# EAGLE design sunbeamB (EAGLE 6.0)
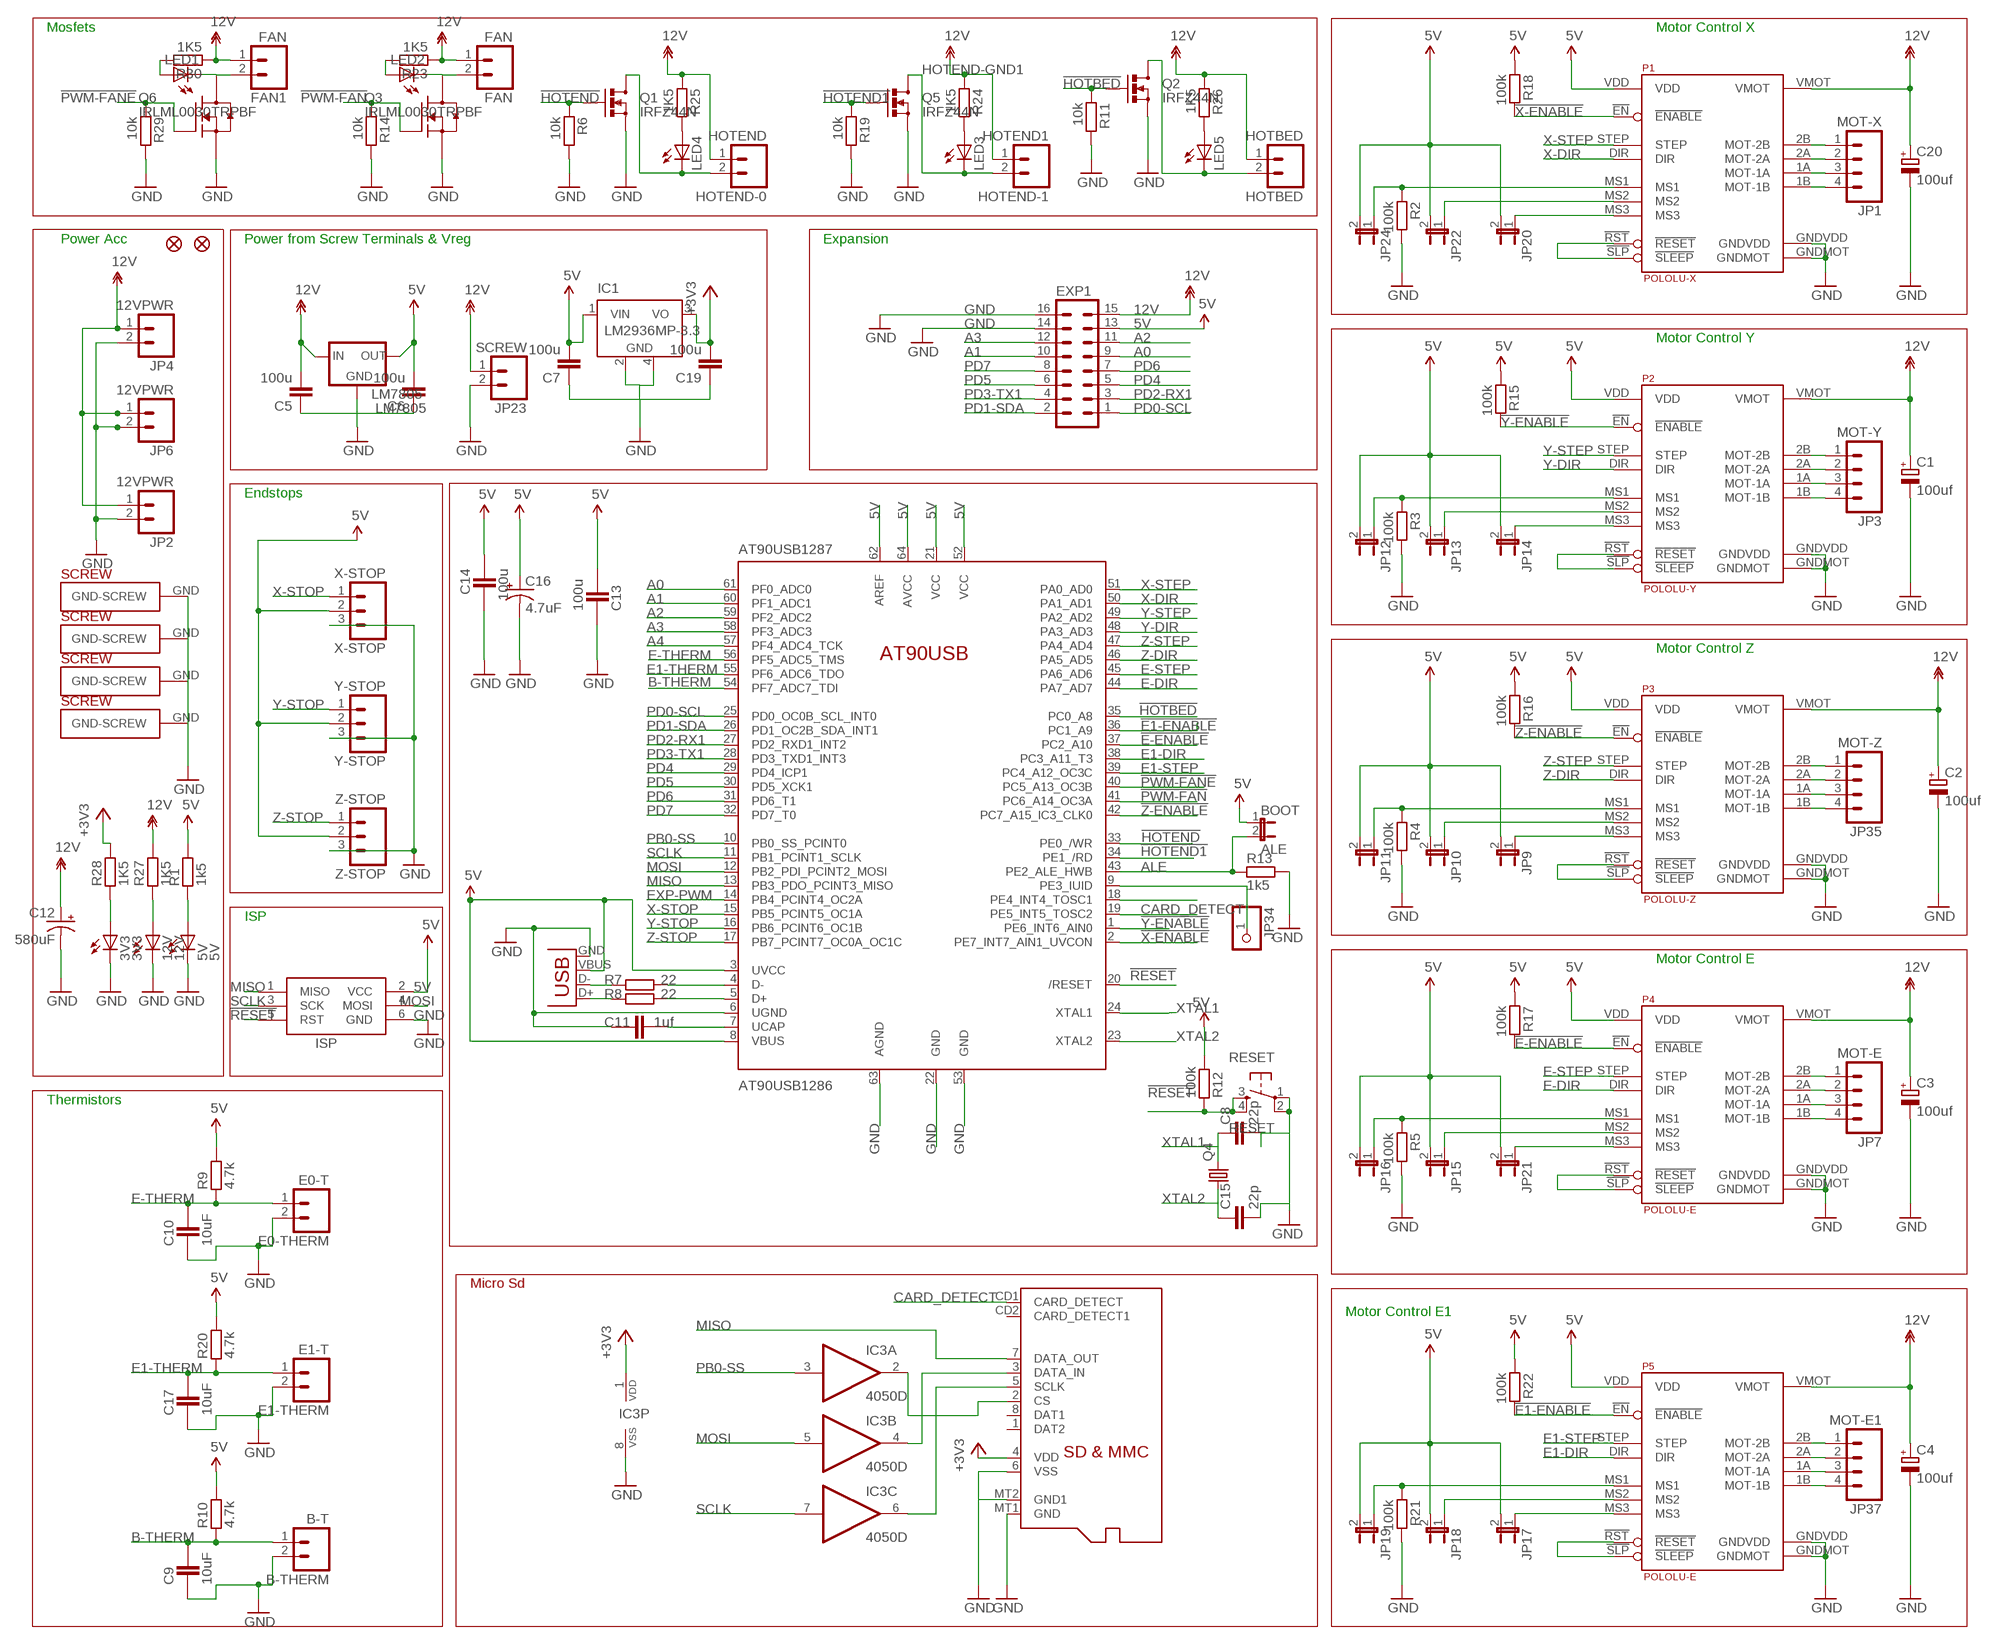
[diagram p0: schematic, sheet 1]

## Parts
3V3  3V3  LEDCHIPLED_0805  [CHIPLED_0805]
5V  5V  LEDCHIPLED_0805  [CHIPLED_0805]
12V  12V  LEDCHIPLED_0805  [CHIPLED_0805]
AT90USB1287  AT90USB1286  AT90USB  [TQFP64-2]
B-THERM  B-T  M02POLAR  [MOLEX-1X2]
BOOT  ALE  JUMPER-2PTH  [1X02]
C1  100uf  CPOL-EUUD-6,3X7,7  [UD-6,3X7,7_NICHICON]
C2  100uf  CPOL-EUUD-6,3X7,7  [UD-6,3X7,7_NICHICON]
C3  100uf  CPOL-EUUD-6,3X7,7  [UD-6,3X7,7_NICHICON]
C4  100uf  CPOL-EUUD-6,3X7,7  [UD-6,3X7,7_NICHICON]
C5  100u  C-EUC0805  [C0805]
C6  100u  C-EUC0805  [C0805]
C7  100u  C-EUC0805  [C0805]
C8  22p  C-EUC0805  [C0805]
C9  10uF  CAPACITOR_0805  [CAPC2012X145AN]
C10  10uF  CAPACITOR_0805  [CAPC2012X145AN]
C11  1uf  CAPACITOR_0805  [CAPC2012X145AN]
C12  580uF  CAP_POLPTH4  [CPOL-RADIAL-1000UF-25V]
C13  100u  CAPACITOR_0805  [CAPC2012X145AN]
C14  100u  CAPACITOR_0805  [CAPC2012X145AN]
C15  22p  C-EUC0805  [C0805]
C16  4.7uF  CAP_POLPTH2  [CPOL-RADIAL-10UF-25V]
C17  10uF  CAPACITOR_0805  [CAPC2012X145AN]
C19  100u  C-EUC0805  [C0805]
C20  100uf  CPOL-EUUD-6,3X7,7  [UD-6,3X7,7_NICHICON]
E0-THERM  E0-T  M02POLAR  [MOLEX-1X2]
E1-THERM  E1-T  M02POLAR  [MOLEX-1X2]
EXP1  MA08-2  [MA08-2]
FAN  FAN  M02POLAR  [MOLEX-1X2]
FAN1  FAN  M02POLAR  [MOLEX-1X2]
HOTBED  HOTBED  M025MM  [SCREWTERMINAL-5MM-2]
HOTEND-0  HOTEND  M025MM  [SCREWTERMINAL-5MM-2]
HOTEND-1  HOTEND1  M025MM  [SCREWTERMINAL-5MM-2]
IC1  LM2936MP-3.3  [SOT223]
IC3  4050D  [SO16]
ISP  ISP  AVRISP-6  [AVRISP]
J1  USB  USBPTH  [USB-B-PTH]
JP1  MOT-X  M04POLAR  [MOLEX-1X4]
JP2  12VPWR  M02POLAR  [MOLEX-1X2]
JP3  MOT-Y  M04POLAR  [MOLEX-1X4]
JP4  12VPWR  M02POLAR  [MOLEX-1X2]
JP5  FIDUCIAL1X2.5  [FIDUCIAL-1X2.5]
JP6  12VPWR  M02POLAR  [MOLEX-1X2]
JP7  MOT-E  M04POLAR  [MOLEX-1X4]
JP8  FIDUCIAL1X2.5  [FIDUCIAL-1X2.5]
JP9  JUMPER-2-OLDSMD-NO  [SJ_2S-NO]
JP10  JUMPER-2-OLDSMD-NO  [SJ_2S-NO]
JP11  JUMPER-2-OLDSMD-NO  [SJ_2S-NO]
JP12  JUMPER-2-OLDSMD-NO  [SJ_2S-NO]
JP13  JUMPER-2-OLDSMD-NO  [SJ_2S-NO]
JP14  JUMPER-2-OLDSMD-NO  [SJ_2S-NO]
JP15  JUMPER-2-OLDSMD-NO  [SJ_2S-NO]
JP16  JUMPER-2-OLDSMD-NO  [SJ_2S-NO]
JP17  JUMPER-2-OLDSMD-NO  [SJ_2S-NO]
JP18  JUMPER-2-OLDSMD-NO  [SJ_2S-NO]
JP19  JUMPER-2-OLDSMD-NO  [SJ_2S-NO]
JP20  JUMPER-2-OLDSMD-NO  [SJ_2S-NO]
JP21  JUMPER-2-OLDSMD-NO  [SJ_2S-NO]
JP22  JUMPER-2-OLDSMD-NO  [SJ_2S-NO]
JP23  SCREW  M025MM  [SCREWTERMINAL-5MM-2]
JP24  JUMPER-2-OLDSMD-NO  [SJ_2S-NO]
JP34  PINHD-1X1  [1X01]
JP35  MOT-Z  M04POLAR  [MOLEX-1X4]
JP37  MOT-E1  M04POLAR  [MOLEX-1X4]
LED1  LEDCHIPLED_0805  [CHIPLED_0805]
LED2  LEDCHIPLED_0805  [CHIPLED_0805]
LED3  LEDCHIPLED_0805  [CHIPLED_0805]
LED4  LEDCHIPLED_0805  [CHIPLED_0805]
LED5  LEDCHIPLED_0805  [CHIPLED_0805]
LM7805  LM7805  V_REG_78XX  [78XXL-CUSTOM]
MICRO-SD  MICROSD  [MICROSD]
P1  POLOLU-X  POLOLU-ALLEGRO  [POLOLU-ALLEGRO-PTH]
P2  POLOLU-Y  POLOLU-ALLEGRO  [POLOLU-ALLEGRO-PTH]
P3  POLOLU-Z  POLOLU-ALLEGRO  [POLOLU-ALLEGRO-PTH]
P4  POLOLU-E  POLOLU-ALLEGRO  [POLOLU-ALLEGRO-PTH]
P5  POLOLU-E  POLOLU-ALLEGRO  [POLOLU-ALLEGRO-PTH]
Q1  IRFZ44N  MOSFET-NCHANNELPTH2  [TO220V]
Q2  IRFZ44N  MOSFET-NCHANNELPTH2  [TO220V]
Q3  IRLML0030TRPBF  MOSFET-NCH_SOT-23  [SOT95P280X135-3N]
Q4  CRYSTALHC49UP  [HC49UP]
Q5  IRFZ44N  MOSFET-NCHANNELPTH2  [TO220V]
Q6  IRLML0030TRPBF  MOSFET-NCH_SOT-23  [SOT95P280X135-3N]
R1  1k5  RESISTOR_0805  [RESC2012X70N]
R2  100k  RESISTOR_0805  [RESC2012X70N]
R3  100k  RESISTOR_0805  [RESC2012X70N]
R4  100k  RESISTOR_0805  [RESC2012X70N]
R5  100k  RESISTOR_0805  [RESC2012X70N]
R6  10k  RESISTOR_0805  [RESC2012X70N]
R7  22  RESISTOR_0805  [RESC2012X70N]
R8  22  RESISTOR_0805  [RESC2012X70N]
R9  4.7k  RESISTOR_0805  [RESC2012X70N]
R10  4.7k  RESISTOR_0805  [RESC2012X70N]
R11  10k  RESISTOR_0805  [RESC2012X70N]
R12  100k  RESISTOR_0805  [RESC2012X70N]
R13  1k5  RESISTOR_0805  [RESC2012X70N]
R14  10k  RESISTOR_0805  [RESC2012X70N]
R15  100k  RESISTOR_0805  [RESC2012X70N]
R16  100k  RESISTOR_0805  [RESC2012X70N]
R17  100k  RESISTOR_0805  [RESC2012X70N]
R18  100k  RESISTOR_0805  [RESC2012X70N]
R19  10k  RESISTOR_0805  [RESC2012X70N]
R20  4.7k  RESISTOR_0805  [RESC2012X70N]
R21  100k  RESISTOR_0805  [RESC2012X70N]
R22  100k  RESISTOR_0805  [RESC2012X70N]
R23  1K5  RESISTOR_0805  [RESC2012X70N]
R24  1K5  RESISTOR_0805  [RESC2012X70N]
R25  1K5  RESISTOR_0805  [RESC2012X70N]
R26  1K5  RESISTOR_0805  [RESC2012X70N]
R27  1K5  RESISTOR_0805  [RESC2012X70N]
R28  1K5  RESISTOR_0805  [RESC2012X70N]
R29  10k  RESISTOR_0805  [RESC2012X70N]
R30  1K5  RESISTOR_0805  [RESC2012X70N]
RESET  RESET  TAC_SWITCHPTH  [TACTILE-PTH]
U$47  PLATED-SCREW  [PLATEDSCREW]
U$48  PLATED-SCREW  [PLATEDSCREW]
U$49  PLATED-SCREW  [PLATEDSCREW]
U$50  PLATED-SCREW  [PLATEDSCREW]
X-STOP  X-STOP  M03POLAR  [MOLEX-1X3]
Y-STOP  Y-STOP  M03POLAR  [MOLEX-1X3]
Z-STOP  Z-STOP  M03POLAR  [MOLEX-1X3]

## Nets
5V: AT90USB1287.3(UVCC) AT90USB1287.8(VBUS) AT90USB1287.21(VCC) AT90USB1287.52(VCC) AT90USB1287.62(AREF) AT90USB1287.64(AVCC) BOOT.1 C6.2 C7.2 C13.2 C14.1 C16.1(+) EXP1.13 IC1.1(VIN) ISP.2(VCC) J1.VBUS JP9.2 JP10.2 JP11.2 JP12.2 JP13.2 JP14.2 JP15.2 JP16.2 JP17.2 JP18.2 JP19.2 JP20.2 JP21.2 JP22.2 JP24.2 LM7805.OUT P1.VDD P2.VDD P3.VDD P4.VDD P5.VDD R1.2 R9.2 R10.2 R12.2 R15.1 R16.1 R17.1 R18.1 R20.2 R22.1 X-STOP.2 Y-STOP.2 Z-STOP.2
12V: C1.+ C2.+ C3.+ C4.+ C5.2 C12.1(+) C20.+ EXP1.15 FAN1.1 FAN.1 HOTBED.1 HOTEND-0.1 HOTEND-1.1 JP2.1 JP4.1 JP6.1 JP23.1 LM7805.IN P1.VMOT P2.VMOT P3.VMOT P4.VMOT P5.VMOT R23.1 R24.1 R25.1 R26.1 R27.2 R30.1
!E1-ENABLE: AT90USB1287.36(PC1_A9) P5.!EN(!ENABLE) R22.2
!E-ENABLE: AT90USB1287.37(PC2_A10) P4.!EN(!ENABLE) R17.2
!HOTBED: AT90USB1287.35(PC0_A8) Q2.1(G) R11.1
!HOTEND: AT90USB1287.33(PE0_/WR) Q1.1(G) R6.1
!HOTEND1: AT90USB1287.34(PE1_/RD) Q5.1(G) R19.1
!PWM-FAN: AT90USB1287.41(PC6_A14_OC3A) Q3.1(G) R14.1
!PWM-FANE: AT90USB1287.40(PC5_A13_OC3B) Q6.1(G) R29.1
!RESET: AT90USB1287.20(/RESET) ISP.5(RST) R12.1 RESET.3 RESET.4
!X-ENABLE: AT90USB1287.2(PE7_INT7_AIN1_UVCON) P1.!EN(!ENABLE) R18.2
!Y-ENABLE: AT90USB1287.1(PE6_INT6_AIN0) P2.!EN(!ENABLE) R15.2
!Z-ENABLE: AT90USB1287.42(PC7_A15_IC3_CLK0) P3.!EN(!ENABLE) R16.2
+3V3: C19.2 IC1.3(VO) IC3.1(P:VDD) MICRO-SD.4(VDD) R28.2
A0: AT90USB1287.61(PF0_ADC0) EXP1.9
A1: AT90USB1287.60(PF1_ADC1) EXP1.10
A2: AT90USB1287.59(PF2_ADC2) EXP1.11
A3: AT90USB1287.58(PF3_ADC3) EXP1.12
A4: AT90USB1287.57(PF4_ADC4_TCK)
ALE: AT90USB1287.43(PE2_ALE_HWB) BOOT.2 R13.1
B-THERM: AT90USB1287.54(PF7_ADC7_TDI) B-THERM.1 C9.2 R10.1
CARD_DETECT: AT90USB1287.19(PE5_INT5_TOSC2) MICRO-SD.CD1(CARD_DETECT)
E1-DIR: AT90USB1287.38(PC3_A11_T3) P5.DIR
E1-STEP: AT90USB1287.39(PC4_A12_OC3C) P5.STEP
E1-THERM: AT90USB1287.55(PF6_ADC6_TDO) C17.2 E1-THERM.1 R20.1
E-DIR: AT90USB1287.44(PA7_AD7) P4.DIR
E-MOT-1A [power]: JP7.3 P4.1A(MOT-1A)
E-MOT-1A1 [power]: JP37.3 P5.1A(MOT-1A)
E-MOT-1B [power]: JP7.4 P4.1B(MOT-1B)
E-MOT-1B1 [power]: JP37.4 P5.1B(MOT-1B)
E-MOT-2A [power]: JP7.2 P4.2A(MOT-2A)
E-MOT-2A1 [power]: JP37.2 P5.2A(MOT-2A)
E-MOT-2B [power]: JP7.1 P4.2B(MOT-2B)
E-MOT-2B1 [power]: JP37.1 P5.2B(MOT-2B)
E-MS1: JP16.1 P4.MS1 R5.1
E-MS2: JP15.1 P4.MS2
E-MS3: JP21.1 P4.MS3
E-MS4: JP19.1 P5.MS1 R21.1
E-MS5: JP18.1 P5.MS2
E-MS6: JP17.1 P5.MS3
E-RESETSLEEP: P4.!RST(!RESET) P4.!SLP(!SLEEP)
E-RESETSLEEP1: P5.!RST(!RESET) P5.!SLP(!SLEEP)
E-STEP: AT90USB1287.45(PA6_AD6) P4.STEP
E-THERM: AT90USB1287.56(PF5_ADC5_TMS) C10.2 E0-THERM.1 R9.1
EXP-PWM: AT90USB1287.14(PB4_PCINT4_OC2A)
GND [power]: 3V3.C 5V.C 12V.C AT90USB1287.6(UGND) AT90USB1287.22(GND) AT90USB1287.53(GND) AT90USB1287.63(AGND) B-THERM.2 C1.- C2.- C3.- C4.- C5.1 C6.1 C7.1 C8.2 C9.1 C10.1 C11.1 C12.2(-) C13.1 C14.2 C15.2 C16.2(-) C17.1 C19.1 C20.- E0-THERM.2 E1-THERM.2 EXP1.14 EXP1.16 IC1.2(GND) IC1.4(GND) IC3.8(P:VSS) ISP.6(GND) J1.GND JP2.2 JP4.2 JP6.2 JP23.2 LM7805.GND MICRO-SD.6(VSS) MICRO-SD.MT1(GND) MICRO-SD.MT2(GND1) P1.GNDMOT P1.GNDVDD P2.GNDMOT P2.GNDVDD P3.GNDMOT P3.GNDVDD P4.GNDMOT P4.GNDVDD P5.GNDMOT P5.GNDVDD Q1.3(S) Q2.3(S) Q3.2(S) Q5.3(S) Q6.2(S) R2.2 R3.2 R4.2 R5.2 R6.2 R11.2 R13.2 R14.2 R19.2 R21.2 R29.2 RESET.1 RESET.2 U$47.GND(GND-SCREW) U$48.GND(GND-SCREW) U$49.GND(GND-SCREW) U$50.GND(GND-SCREW) X-STOP.3 Y-STOP.3 Z-STOP.3
HOTBED-GND [power]: HOTBED.2 LED5.C Q2.2(D)
HOTEND-GND: HOTEND-0.2 LED4.C Q1.2(D)
HOTEND-GND1 [power]: HOTEND-1.2 LED3.C Q5.2(D)
MISO: AT90USB1287.13(PB3_PDO_PCINT3_MISO) ISP.1(MISO) MICRO-SD.7(DATA_OUT)
MOSI: AT90USB1287.12(PB2_PDI_PCINT2_MOSI) IC3.5(B:I) ISP.4(MOSI)
N$1: 5V.A R1.1
N$2: J1.D- R7.1
N$3: AT90USB1287.4(D-) R7.2
N$4: AT90USB1287.5(D+) R8.2
N$5: J1.D+ R8.1
N$6: FAN.2 LED2.C Q3.3(D)
N$7: AT90USB1287.9(PE3_IUID) JP34.1
N$8: LED2.A R23.2
N$9: AT90USB1287.7(UCAP) C11.2
N$10: 3V3.A R28.1
N$11: LED4.A R25.2
N$12: LED3.A R24.2
N$13: LED5.A R26.2
N$14: 12V.A R27.1
N$15: AT90USB1287.18(PE4_INT4_TOSC1)
N$16: IC3.6(C:O) MICRO-SD.5(SCLK)
N$17: IC3.4(B:O) MICRO-SD.3(DATA_IN)
N$18: IC3.2(A:O) MICRO-SD.2(CS)
N$20: FAN1.2 LED1.C Q6.3(D)
N$21: LED1.A R30.2
PB0-SS: AT90USB1287.10(PB0_SS_PCINT0) IC3.3(A:I)
PD0-SCL: AT90USB1287.25(PD0_OC0B_SCL_INT0) EXP1.1
PD1-SDA: AT90USB1287.26(PD1_OC2B_SDA_INT1) EXP1.2
PD2-RX1: AT90USB1287.27(PD2_RXD1_INT2) EXP1.3
PD3-TX1: AT90USB1287.28(PD3_TXD1_INT3) EXP1.4
PD4: AT90USB1287.29(PD4_ICP1) EXP1.5
PD5: AT90USB1287.30(PD5_XCK1) EXP1.6
PD6: AT90USB1287.31(PD6_T1) EXP1.7
PD7: AT90USB1287.32(PD7_T0) EXP1.8
SCLK: AT90USB1287.11(PB1_PCINT1_SCLK) IC3.7(C:I) ISP.3(SCK)
X-DIR: AT90USB1287.50(PA1_AD1) P1.DIR
X-MOT-1A [power]: JP1.3 P1.1A(MOT-1A)
X-MOT-1B [power]: JP1.4 P1.1B(MOT-1B)
X-MOT-2A [power]: JP1.2 P1.2A(MOT-2A)
X-MOT-2B [power]: JP1.1 P1.2B(MOT-2B)
X-MS1: JP24.1 P1.MS1 R2.1
X-MS2: JP22.1 P1.MS2
X-MS3: JP20.1 P1.MS3
X-RESETSLEEP: P1.!RST(!RESET) P1.!SLP(!SLEEP)
X-STEP: AT90USB1287.51(PA0_AD0) P1.STEP
X-STOP: AT90USB1287.15(PB5_PCINT5_OC1A) X-STOP.1
XTAL1: AT90USB1287.24(XTAL1) C8.1 Q4.2
XTAL2: AT90USB1287.23(XTAL2) C15.1 Q4.1
Y-DIR: AT90USB1287.48(PA3_AD3) P2.DIR
Y-MOT-1A [power]: JP3.3 P2.1A(MOT-1A)
Y-MOT-1B [power]: JP3.4 P2.1B(MOT-1B)
Y-MOT-2A [power]: JP3.2 P2.2A(MOT-2A)
Y-MOT-2B [power]: JP3.1 P2.2B(MOT-2B)
Y-MS1: JP12.1 P2.MS1 R3.1
Y-MS2: JP13.1 P2.MS2
Y-MS3: JP14.1 P2.MS3
Y-RESETSLEEP: P2.!RST(!RESET) P2.!SLP(!SLEEP)
Y-STEP: AT90USB1287.49(PA2_AD2) P2.STEP
Y-STOP: AT90USB1287.16(PB6_PCINT6_OC1B) Y-STOP.1
Z-DIR: AT90USB1287.46(PA5_AD5) P3.DIR
Z-MOT-1A [power]: JP35.3 P3.1A(MOT-1A)
Z-MOT-1B [power]: JP35.4 P3.1B(MOT-1B)
Z-MOT-2A [power]: JP35.2 P3.2A(MOT-2A)
Z-MOT-2B [power]: JP35.1 P3.2B(MOT-2B)
Z-MS1: JP11.1 P3.MS1 R4.1
Z-MS2: JP10.1 P3.MS2
Z-MS3: JP9.1 P3.MS3
Z-RESETSLEEP: P3.!RST(!RESET) P3.!SLP(!SLEEP)
Z-STEP: AT90USB1287.47(PA4_AD4) P3.STEP
Z-STOP: AT90USB1287.17(PB7_PCINT7_OC0A_OC1C) Z-STOP.1
Unconnected: IC3.9(D:I) IC3.10(D:O) IC3.11(E:I) IC3.12(E:O) IC3.14(F:I) IC3.15(F:O) MICRO-SD.1(DAT2) MICRO-SD.8(DAT1) MICRO-SD.CD2(CARD_DETECT1)

## Notes on the sheet
- Mosfets | Motor Control X
- Power Acc | Power from Screw Terminals & Vreg | Expansion
- Motor Control Y
- Endstops
- Motor Control Z
- ISP
- Motor Control E
- Thermistors
- Micro Sd
- Motor Control E1

## Library data of the parts
3V3 5V 12V LED1-LED5 = led:LED: LED OSRAM: - CHIPLED LG R971, LG N971, LY N971, LG Q971, LY Q971, LO R971, LY R971 LH N974, LH R974 LS Q976, LO Q976, LY Q976 LO Q996 - Hyper CHIPLED LW Q18S LB Q993, LB Q99A, LB R99A - SideLED LS A670, LO A670, LY A670, LG A670, LP A670 LB A673, LV A673, LT A673, LW A673 LH A674 LY A675 LS A676, LA A676, LO A676, LY A676, LW A676 LS A679, LY A679, LG A679 - Hyper Micro SIDELED® LS Y876, LA Y876, LO Y876, LY Y876 LT Y87S - SmartLED LW L88C, LW L88S LB L89C, LB L89S, LG L890 LS L89K, LO L89K, LY L89K LS L896, LA L896, LO L896, LY L896 - TOPLED LS T670, LO T670, LY T670, LG T670, LP T670 LSG T670, LSP T670, LSY T670, LOP T670, LYG T670 LG T671, LOG T671, LSG T671 LB T673, LV T673, LT T673, LW T673 LH T674 LS T676, LA T676, LO T676, LY T676, LB T676, LH T676, LSB T676, LW T676 LB T67C, LV T67C, LT T67C, LS T67K, LO T67K, LY T67K, LW E67C LS E67B, LA E67B, LO E67B, LY E67B, LB E67C, LV E67C, LT E67C LW T67C LS T679, LY T679, LG T679 LS T770, LO T770, LY T770, LG T770, LP T770 LB T773, LV T773, LT T773, LW T773 LH T774 LS E675, LA E675, LY E675, LS T675 LS T776, LA T776, LO T776, LY T776, LB T776 LHGB T686 LT T68C, LB T68C - Hyper Mini TOPLED® LB M676 - Mini TOPLED Santana® LG M470 LS M47K, LO M47K, LY M47K Source: http://www.osram.convergy.de LUXEON: - LUMILED® LXK2-PW12-R00, LXK2-PW12-S00, LXK2-PW14-U00, LXK2-PW14-V00 LXK2-PM12-R00, LXK2-PM12-S00, LXK2-PM14-U00 LXK2-PE12-Q00, LXK2-PE12-R00, LXK2-PE12-S00, LXK2-PE14-T00, LXK2-PE14-U00 LXK2-PB12-K00, LXK2-PB12-L00, LXK2-PB12-M00, LXK2-PB14-N00, LXK2-PB14-P00, LXK2-PB14-Q00 LXK2-PR12-L00, LXK2-PR12-M00, LXK2-PR14-Q00, LXK2-PR14-R00 LXK2-PD12-Q00, LXK2-PD12-R00, LXK2-PD12-S00 LXK2-PH12-R00, LXK2-PH12-S00 LXK2-PL12-P00, LXK2-PL12-Q00, LXK2-PL12-R00 Source: www.luxeon.com KINGBRIGHT: KA-3528ASYC Source: www.kingbright.com
AT90USB1287 = Atmel-at90usb-teensy:AT90USB
B-THERM E0-THERM E1-THERM FAN FAN1 HOTBED HOTEND-0 HOTEND-1 JP2 JP4 JP6 JP23 = SparkFun:M02: Header 2 Standard 2-pin 0.1" header. Use with straight break away headers (SKU : PRT-00116), right angle break away headers (PRT-00553), swiss pins (PRT-00743), machine pins (PRT-00117), and female headers (PRT-00115). Molex polarized connector foot print use with SKU : PRT-08233 with associated crimp pins and housings.
BOOT = SparkFun:JUMPER-2: Jumper Basic 0.1" spaced jumper. Use with breakaway headers.
C1-C4 C20 = rcl:CPOL-EU: POLARIZED CAPACITOR, European symbol
C5-C8 C15 C19 = rcl:C-EU: CAPACITOR, European symbol
C9-C11 C13 C14 C17 = ipc-7351-capacitor:CAPACITOR_
C12 C16 = SparkFun:CAP_POL: Capacitor Polarized These are standard SMD and PTH capacitors. Normally 10uF, 47uF, and 100uF in electrolytic and tantalum varieties. Always verify the external diameter of the through hole cap, it varies with capacity, voltage, and manufacturer. The EIA devices should be standard.
EXP1 = con-lstb:MA08-2: PIN HEADER; OC_FARNELL: unknown; OC_NEWARK: unknown
IC1 = national-semiconductor:LM2936MP?*: Ultra-Low Quiescent Current LDO Voltage Regulator Source: Data sheet <http://www.national.com/ds/LM/LM2936.pdf>; MF: NATIONAL SEMICONDUCTOR; MPN: LM2936MP-3.3/NOPB; OC_FARNELL: 1469062; OC_NEWARK: 41K4523
IC3 = 40xx:4050: Hex non-inverting BUFFER
ISP = adafruit:AVRISP: AVR ISP HEADER Standard 6 pin header for AVR programming
J1 = SparkFun:USB: USB Connectors USB-B-PTH is fully proven SKU : PRT-00139 USB-miniB is fully proven SKU : PRT-00587 USB-A-PCB is untested. USB-A-H is throughly reviewed, but untested. Spark Fun Electronics SKU : PRT-00437 USB-B-SMT is throughly reviewed, but untested. Needs silkscreen touching up. USB-A-S has not been used/tested USB-MB-H has not been used/tested
JP1 JP3 JP7 JP35 JP37 = SparkFun:M04: Header 4 Standard 4-pin 0.1" header. Use with straight break away headers (SKU : PRT-00116), right angle break away headers (PRT-00553), swiss pins (PRT-00743), machine pins (PRT-00117), and female headers (PRT-00115). Molex polarized connector foot print use with SKU : PRT-08231 with associated crimp pins and housings.
JP5 JP8 = SparkFun:FIDUCIAL: Fiducial Alignment Points Various fiducial points for machine vision alignment.
JP9-JP22 JP24 = SparkFun:JUMPER-2-OLD: Jumper Basic 0.1" spaced jumper. Use with breakaway headers.
JP34 = pinhead:PINHD-1X1: PIN HEADER
LM7805 = SparkFun:V_REG_78XX: Voltage Regulator Standard 7805 5V regulator. IGO (Input Ground Output). Spark Fun Electronics SKU : COM-00107
MICRO-SD = adafruit:MICROSD: Micro-SD / Transflash card holder with SPI pinout For the 3M # 2908-05WB-MG and/or 4UCON #19656 push-push type
P1-P5 = pololu-allegro:POLOLU-ALLEGRO
Q1 Q2 Q5 = SparkFun:MOSFET-NCHANNEL
Q3 Q6 = ipc-7351-transistor:MOSFET-NCH_
Q4 = crystal:CRYSTAL: CRYSTAL; OC_FARNELL: unknown; OC_NEWARK: unknown
R1-R30 = ipc-7351-resistor:RESISTOR_
RESET = SparkFun:TAC_SWITCH: Momentary Switch Button commonly used for reset or general input. Spark Fun Electronics SKU : COM-00097
U$47-U$50 = Sanguinololu:PLATED-SCREW
X-STOP Y-STOP Z-STOP = SparkFun:M03: Header 3 Standard 3-pin 0.1" header. Use with straight break away headers (SKU : PRT-00116), right angle break away headers (PRT-00553), swiss pins (PRT-00743), machine pins (PRT-00117), and female headers (PRT-00115). Molex polarized connector foot print use with SKU : PRT-08232 with associated crimp pins and housings.

## Board
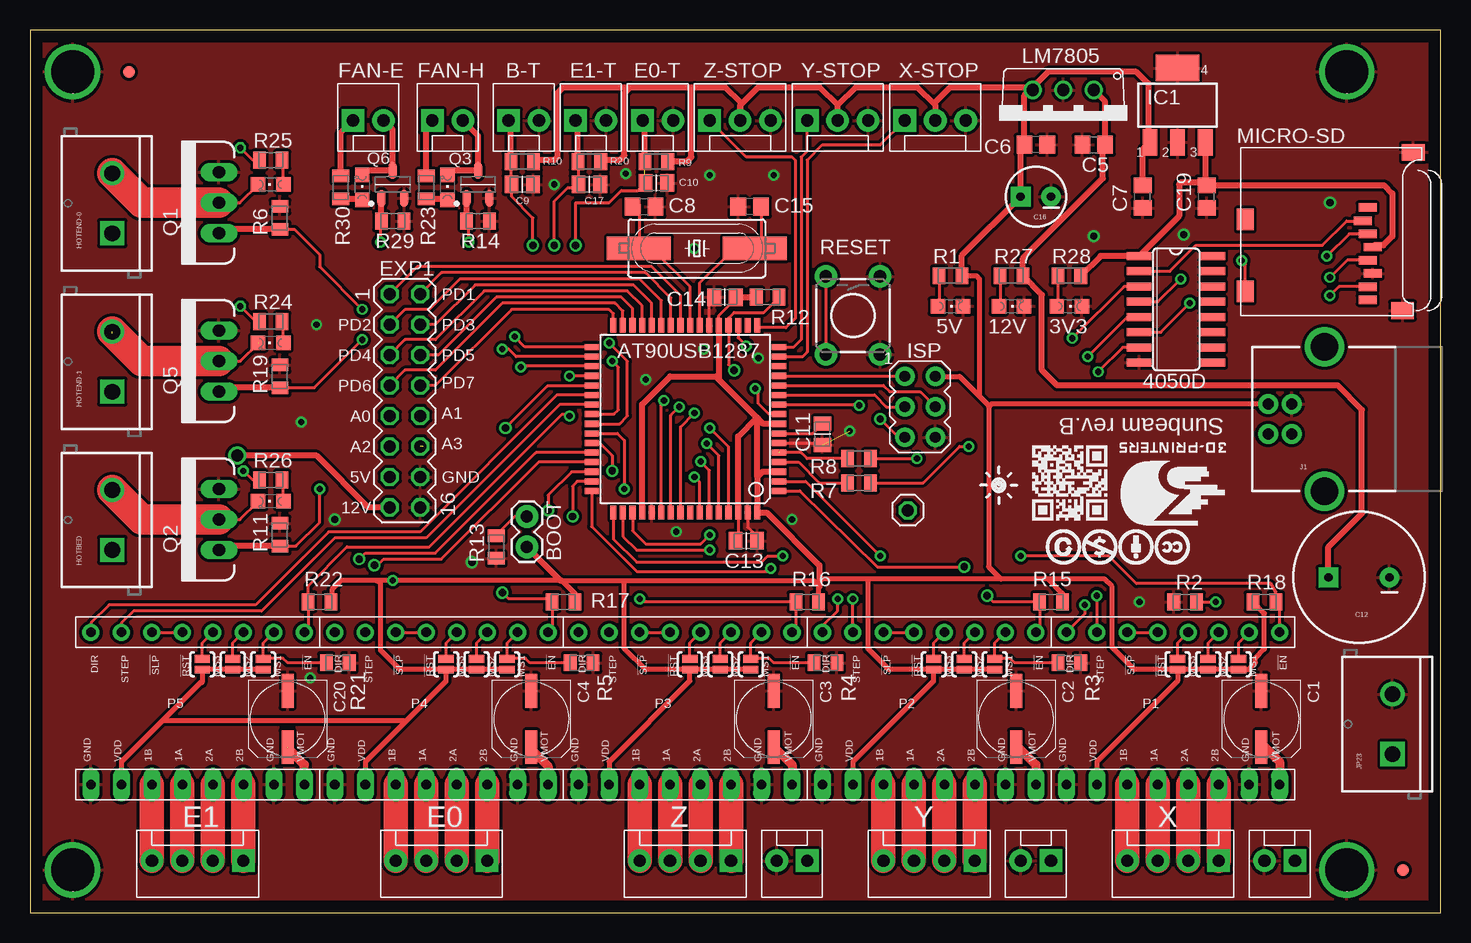
[diagram p1: board, top side]
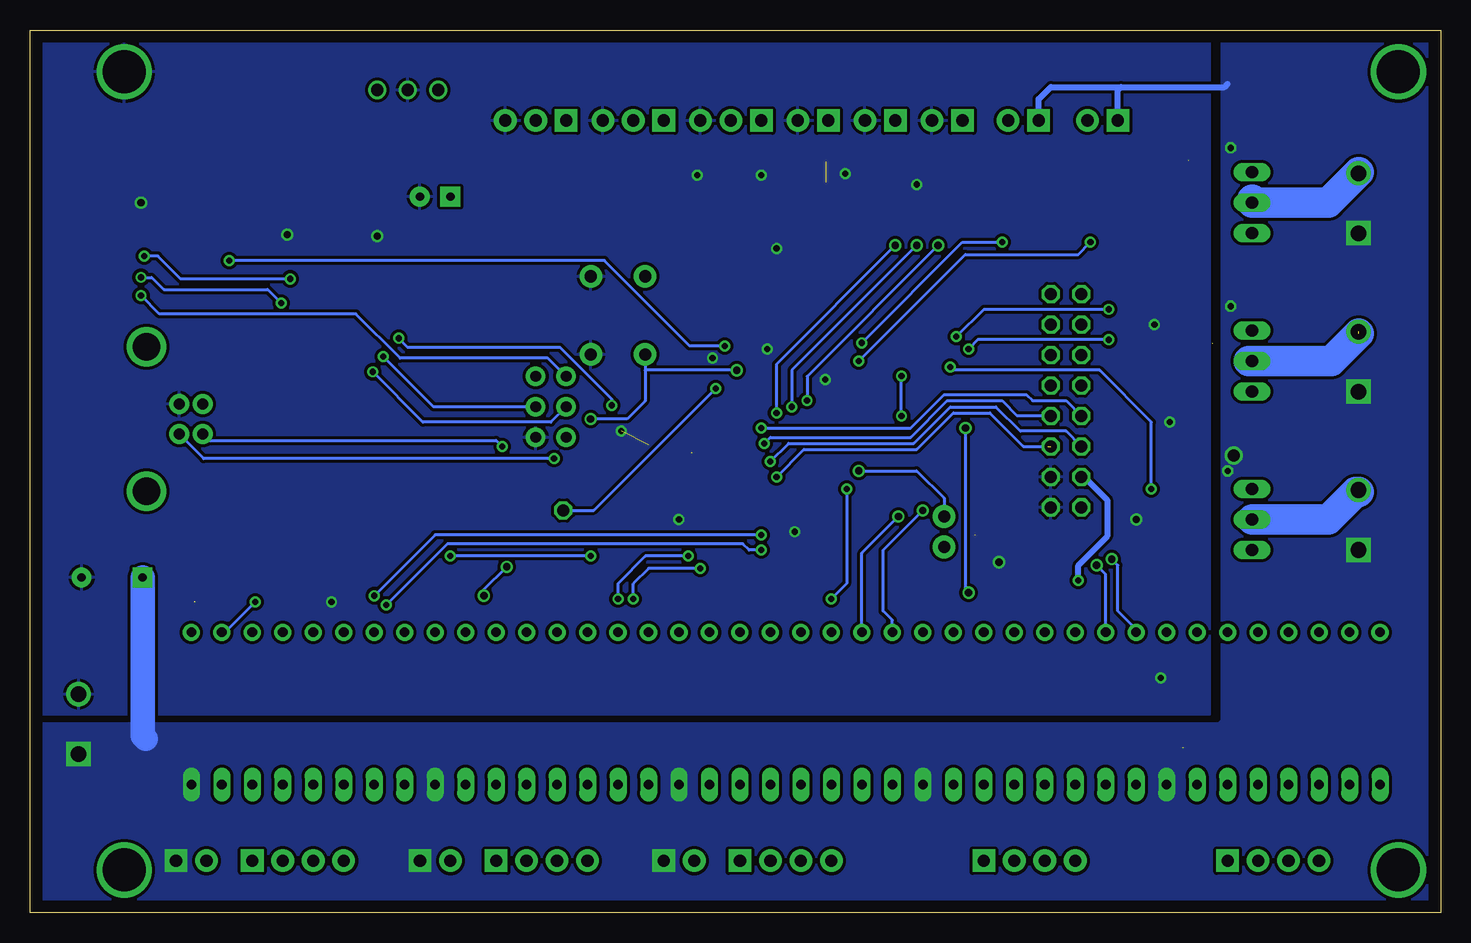
[diagram p2: board, bottom side, seen from below]

Size 117.58 x 73.58 mm. Coordinates in mm from the lower left corner, seen from the top.
Outline: 0,0 117.58,0 117.58,73.58 0,73.58 0,0
Copper layers (1*16): Top 0.035mm / dielectric 1.5mm / Bottom 0.035mm
Design rules: minimum track width 10mil, minimum drill 8mil, track to track 10mil, track to pad 10mil, pad to pad 10mil, via to via 10mil, smd to smd 10mil, copper to edge 40mil, drill to drill 8mil, minimum pad ring 10mil, minimum via ring 8mil, stop-mask expansion 4mil, vias tented up to drill 0mil, thermal gap 10mil

### Footprints (pad centres in the part's own frame; a part is rotated, then mirrored left to right if it is on the bottom)
CHIPLED_0805 = smd 1.2 x 1.2: A 0,-1.05; C 0,1.05
TQFP64-2 = smd 1.194 x 0.508: 1 -7.8,6; 2 -7.8,5.2; 3 -7.8,4.4; 4 -7.8,3.6; 5 -7.8,2.8; 6 -7.8,2; 7 -7.8,1.2; 8 -7.8,0.4; 9 -7.8,-0.4; 10 -7.8,-1.2; 11 -7.8,-2; 12 -7.8,-2.8; 13 -7.8,-3.6; 14 -7.8,-4.4; 15 -7.8,-5.2; 16 -7.8,-6; 33 7.8,-6; 34 7.8,-5.2; 35 7.8,-4.4; 36 7.8,-3.6; 37 7.8,-2.8; 38 7.8,-2; 39 7.8,-1.2; 40 7.8,-0.4; 41 7.8,0.4; 42 7.8,1.2; 43 7.8,2; 44 7.8,2.8; 45 7.8,3.6; 46 7.8,4.4; 47 7.8,5.2; 48 7.8,6 | smd 0.508 x 1.194: 17 -6,-7.8; 18 -5.2,-7.8; 19 -4.4,-7.8; 20 -3.6,-7.8; 21 -2.8,-7.8; 22 -2,-7.8; 23 -1.2,-7.8; 24 -0.4,-7.8; 25 0.4,-7.8; 26 1.2,-7.8; 27 2,-7.8; 28 2.8,-7.8; 29 3.6,-7.8; 30 4.4,-7.8; 31 5.2,-7.8; 32 6,-7.8; 49 6,7.8; 50 5.2,7.8; 51 4.4,7.8; 52 3.6,7.8; 53 2.8,7.8; 54 2,7.8; 55 1.2,7.8; 56 0.4,7.8; 57 -0.4,7.8; 58 -1.2,7.8; 59 -2,7.8; 60 -2.8,7.8; 61 -3.6,7.8; 62 -4.4,7.8; 63 -5.2,7.8; 64 -6,7.8
MOLEX-1X2 = drill 1.016 pad 1.88 square: 1 0,0 | drill 1.016 pad 1.88: 2 2.54,0
1X02 = drill 1.016 pad 1.88: 1 0,0; 2 2.54,0
UD-6,3X7,7_NICHICON = smd 2.8 x 1: + 2.35,0; - -2.35,0
C0805 = smd 1.3 x 1.5: 1 -0.95,0; 2 0.95,0
CAPC2012X145AN = smd 1.15 x 1.45: 1 -0.9,0; 2 0.9,0
CPOL-RADIAL-1000UF-25V = drill 0.7 pad 1.651 square: 1 2.54,0 | drill 0.7 pad 1.651: 2 -2.54,0
CPOL-RADIAL-10UF-25V = drill 0.7 pad 1.651 square: 1 1.27,0 | drill 0.7 pad 1.651: 2 -1.27,0
MA08-2 = drill 1.016 octagon: 1 -8.89,-1.27; 2 -8.89,1.27; 3 -6.35,-1.27; 4 -6.35,1.27; 5 -3.81,-1.27; 6 -3.81,1.27; 7 -1.27,-1.27; 8 -1.27,1.27; 9 1.27,-1.27; 10 1.27,1.27; 11 3.81,-1.27; 12 3.81,1.27; 13 6.35,-1.27; 14 6.35,1.27; 15 8.89,-1.27; 16 8.89,1.27
SCREWTERMINAL-5MM-2 = drill 1.3 pad 2.032 square: 1 0,0 | drill 1.3 pad 2.032: 2 5,0
SOT223 = smd 1.219 x 2.235: 1 -2.311,-3.099; 2 0,-3.099; 3 2.311,-3.099 | smd 3.6 x 2.2: 4 0,3.099
SO16 = smd 0.66 x 2.032: 1 -4.445,-3.073; 2 -3.175,-3.073; 3 -1.905,-3.073; 4 -0.635,-3.073; 5 0.635,-3.073; 6 1.905,-3.073; 7 3.175,-3.073; 8 4.445,-3.073; 9 4.445,3.073; 10 3.175,3.073; 11 1.905,3.073; 12 0.635,3.073; 13 -0.635,3.073; 14 -1.905,3.073; 15 -3.175,3.073; 16 -4.445,3.073
AVRISP = drill 0.9 pad 1.626: 1 -1.27,2.54; 2 1.27,2.54; 3 -1.27,0; 4 1.27,0; 5 -1.27,-2.54; 6 1.27,-2.54
USB-B-PTH = drill 0.914 pad 1.676: D+ 0,1.25; D- 1.981,1.25; GND 0,-1.25; VBUS 1.981,-1.25 | drill 2.286: P$1 -2.718,-6.02; P$2 -2.718,6.02
MOLEX-1X4 = drill 1.016 pad 1.88 square: 1 0,0 | drill 1.016 pad 1.88: 2 2.54,0; 3 5.08,0; 4 7.62,0
FIDUCIAL-1X2.5 = smd 1 x 1: 1 0,0
SJ_2S-NO = smd 0.635 x 1.27: 1 -0.45,0; 2 0.45,0
1X01 = drill 1.016 octagon: 1 0,0
78XXL-CUSTOM = drill 1.016: GND 0,0; IN -2.54,0; OUT 2.54,0
MICROSD = smd 0.7 x 1.5: 1 9,-10.64; 2 7.9,-10.24; 3 6.8,-10.64; 4 5.7,-11.04; 5 4.6,-10.64; 6 3.5,-11.04; 7 2.4,-10.64; 8 1.3,-10.64 | smd 1.8 x 1.4: CD1 2,-0.44; CD2 8,-0.44 | smd 1.4 x 1.9: MT1 0.4,-13.54; MT2 13.6,-14.44
POLOLU-ALLEGRO-PTH = drill 0.8 pad 1.422 long: 1A 6.35,-1.27; 1B 6.35,-3.81; 2A 6.35,1.27; 2B 6.35,3.81; GNDMOT 6.35,6.35; GNDVDD 6.35,-8.89; VDD 6.35,-6.35; VMOT 6.35,8.89 | drill 0.8 pad 1.422: !EN -6.35,8.89; !RST -6.35,-1.27; !SLP -6.35,-3.81; DIR -6.35,-8.89; MS1 -6.35,6.35; MS2 -6.35,3.81; MS3 -6.35,1.27; STEP -6.35,-6.35
TO220V = drill 1.016 long: 1 -2.54,0; 2 0,0; 3 2.54,0
SOT95P280X135-3N = smd 1.4 x 0.65: 1 -1.15,0.95; 2 -1.15,-0.95; 3 1.15,0
HC49UP = smd 5.334 x 1.93: 1 -4.826,0; 2 4.826,0
RESC2012X70N = smd 1.05 x 1.4: 1 -0.95,0; 2 0.95,0
TACTILE-PTH = drill 1.016 pad 1.88: 1 -3.251,2.261; 2 3.251,2.261; 3 -3.251,-2.261; 4 3.251,-2.261
PLATEDSCREW = drill 3.6: GND 0,0
MOLEX-1X3 = drill 1.016 pad 1.88 square: 1 0,0 | drill 1.016 pad 1.88: 2 2.54,0; 3 5.08,0

### Placement (x,y rotation side)
3V3  86.61,50.55 270 top
5V  76.71,50.55 270 top
12V  81.79,50.55 270 top
AT90USB1287  54.61,41.15 180 top
B-THERM  39.88,66.04 0 top
BOOT  41.4,30.48 90 top
C1  102.62,16.13 270 top
C2  82.17,16.13 270 top
C3  61.98,16.13 270 top
C4  41.78,16.13 270 top
C5  88.65,64.01 0 top
C6  83.82,64.01 180 top
C7  92.71,59.69 90 top
C8  51.17,58.85 0 top
C9  41.02,60.71 180 top
C10  52.2,60.83 180 top
C11  66.04,39.88 90 top
C12  110.74,27.94 180 top
C13  59.69,30.99 180 top
C14  57.91,51.31 180 top
C15  59.97,58.85 180 top
C16  83.82,59.69 180 top
C17  46.61,60.71 180 top
C19  98.04,59.69 90 top
C20  21.46,16.13 270 top
E0-THERM  51.05,66.04 0 top
E1-THERM  45.47,66.04 0 top
EXP1  31.24,42.67 270 top
FAN  33.53,66.04 0 top
FAN1  26.92,66.04 0 top
HOTBED  6.86,30.23 90 top
HOTEND-0  6.86,56.64 90 top
HOTEND-1  6.86,43.43 90 top
IC1  95.63,67.31 0 top
IC3  95.5,50.29 270 top
ISP  74.17,42.16 0 top
J1  105.16,41.15 180 top
JP1  99.06,4.32 180 top
JP2  105.41,4.32 180 top
JP3  78.74,4.32 180 top
JP4  85.09,4.32 180 top
JP5  114.43,3.56 0 top
JP6  64.77,4.32 180 top
JP7  38.1,4.32 180 top
JP8  8.25,70.1 0 top
JP9  54.99,20.7 270 top
JP10  57.53,20.7 270 top
JP11  60.07,20.7 270 top
JP12  80.39,20.7 270 top
JP13  77.85,20.7 270 top
JP14  75.31,20.7 270 top
JP15  37.21,20.7 270 top
JP16  39.75,20.7 270 top
JP17  14.35,20.7 270 top
JP18  16.89,20.7 270 top
JP19  19.43,20.7 270 top
JP20  95.63,20.7 270 top
JP21  34.67,20.7 270 top
JP22  98.17,20.7 270 top
JP23  113.54,13.21 90 top
JP24  100.71,20.7 270 top
JP34  73.15,33.53 270 top
JP35  58.42,4.32 180 top
JP37  17.78,4.32 180 top
LED1  27.69,60.45 0 top
LED2  34.8,60.45 0 top
LED3  20.07,47.5 90 top
LED4  20.07,60.71 90 top
LED5  20.07,34.29 90 top
LM7805  86.11,68.58 180 top
MICRO-SD  100.84,49.78 90 top
P1  95.25,17.02 270 top
P2  74.93,17.02 270 top
P3  54.61,17.02 270 top
P4  34.29,17.02 270 top
P5  13.97,17.02 270 top
Q1  15.75,59.18 90 top
Q2  15.75,32.77 90 top
Q3  37.34,60.71 90 top
Q4  55.57,55.37 180 top
Q5  15.75,45.97 90 top
Q6  30.23,60.71 90 top
R1  76.71,53.09 0 top
R2  96.27,25.91 180 top
R3  86.61,20.83 0 top
R4  66.29,20.83 0 top
R5  45.97,20.83 0 top
R6  20.83,57.91 90 top
R7  69.09,35.81 180 top
R8  69.09,37.85 180 top
R9  52.2,62.61 0 top
R10  41.02,62.61 0 top
R11  20.83,31.5 90 top
R12  61.47,51.31 180 top
R13  38.86,30.48 270 top
R14  37.34,57.66 0 top
R15  85.09,25.91 180 top
R16  64.77,25.91 180 top
R17  44.45,25.91 180 top
R18  102.87,25.91 0 top
R19  20.83,44.7 90 top
R20  46.61,62.61 0 top
R21  25.65,20.83 0 top
R22  24.13,25.91 180 top
R23  33.02,60.45 270 top
R24  20.07,49.28 0 top
R25  20.07,62.74 0 top
R26  20.07,36.07 0 top
R27  81.79,53.09 0 top
R28  86.61,53.09 0 top
R29  30.23,57.66 0 top
R30  25.91,60.45 270 top
RESET  68.58,49.78 270 top
U$47  3.56,3.56 0 top
U$48  3.56,70.1 0 top
U$49  109.73,3.56 0 top
U$50  109.73,70.1 0 top
X-STOP  72.9,66.04 0 top
Y-STOP  64.77,66.04 0 top
Z-STOP  56.64,66.04 0 top

### Tracks (layer width: path | path; a pad name or v marks a point on that pad's centre or on a via)
5V  (via drill 0.51)
  Top 0.254: AT90USB1287.62 59.01,31.21 C13.2 | AT90USB1287.21 57.41,49.79 58.67,51.05 58.67,51.31 58.93,51.31
  Top 0.406: R17.1 45.4,26.61 44.32,27.69 | 44.32,27.69 v30.23,27.69 28.83,27.69 | 28.83,27.69 25.91,27.69 25.15,26.92 25.15,26.42 | 25.15,26.42 25.15,25.91 25.27,25.91 25.27,25.78 | R22.1 25.08,26.35 25.15,26.42 | 44.32,27.69 49.4,27.69 | 49.4,27.69 65.28,27.69 65.79,27.18 | R16.1 65.72,27.24 65.79,27.31 | R15.1 86.04,26.61 84.84,27.81 | 84.84,27.81 80.9,27.81 | 80.9,27.81 69.72,27.81 | 69.72,27.81 66.04,27.81 65.79,27.56 | ISP.2 77.47,44.7 79.12,43.05 | 79.88,42.16 79.88,42.29 79.12,43.05 | 79.88,42.16 79.88,28.83 80.9,27.81 | J1.VBUS 80.12,42.4 79.88,42.16 | R1.2 78.87,53.09 79.12,52.83 79.12,43.05 | JP19.2 JP18.2 JP17.2 14.35,19.18 14.22,19.18 11.05,16 | P5.VDD 7.62,12.57 11.05,16 | JP16.2 JP15.2 37.14,20.32 34.67,20.32 JP21.2 | 31.24,15.88 34.67,19.3 JP21.2 | 31.24,15.88 27.94,12.57 P4.VDD | P3.VDD 48.26,12.57 54.99,19.3 JP9.2 | JP11.2 JP10.2 JP9.2 | JP12.2 JP13.2 JP14.2 | P2.VDD 68.58,12.57 75.31,19.3 JP14.2 | JP20.2 JP22.2 JP24.2 101.53,20.25 102.11,20.83 102.11,21.21 102.87,21.97 102.87,24.96 R18.1 | JP20.2 95.63,19.3 88.9,12.57 P1.VDD | JP20.2 92.02,20.25 90.17,22.1 90.17,27.18 89.53,27.81 84.84,27.81 | JP14.2 71.57,20.25 69.85,21.97 69.85,27.69 69.72,27.81 | JP9.2 51.25,20.25 49.53,21.97 49.53,27.56 49.4,27.69 | JP21.2 30.8,20.25 29.21,21.84 29.21,27.43 28.83,27.69 | 11.05,16 31.12,16 31.24,15.88 | 92.71,62.97 92.71,63.63 92.77,63.69 93.22,64.14
  Top 0.508: 67.31,67.31 65.79,68.83 60.71,68.83 59.18,67.31 Z-STOP.2 59.18,67.56 57.91,68.83 55.37,68.83 | Y-STOP.2 67.31,67.31 | 67.31,67.31 68.83,68.83 73.91,68.83 75.44,67.31 | 75.44,67.31 X-STOP.2 | AT90USB1287.8 61.11,40.75 60.71,41.15 | 60.71,41.15 60.58,41.28 | 60.58,41.28 57.41,44.44 | 57.41,44.44 57.15,44.7 53.34,44.7 51.01,42.37 AT90USB1287.52 | AT90USB1287.21 57.41,44.44 | AT90USB1287.62 59.01,39.71 60.58,41.28 | 60.61,36.32 60.61,41.05 60.71,41.15 | C14.1 58.93,51.31 R12.2 60.45,51.31 | AT90USB1287.3 61.04,36.75 60.61,36.32 | 75.44,67.31 75.44,67.56 76.71,68.83 83.31,68.83 LM7805.OUT 83.31,68.58 | 83.31,68.58 82.87,68.14 C6.2 82.55,63.69 C16.1 77.66,54.8 R1.2 | 65.79,27.18 65.79,27.31 65.79,27.56 65.79,28.96 61.39,33.35 AT90USB1287.64 60.61,36.32 | 49.91,68.71 49.53,68.33 49.53,63.12 49.15,62.74 47.69,62.74 R20.2 | 49.91,68.71 50.04,68.83 55.37,68.83 | 55.37,68.83 55.12,68.58 55.12,62.99 54.74,62.61 R9.2 | 49.91,68.71 49.78,68.83 44.45,68.83 43.94,68.33 43.94,62.99 43.69,62.74 42.1,62.74 R10.2 | 83.31,68.58 84.84,70.1 92.2,70.1 93.19,69.11 93.19,64.34 IC1.1 93.29,64.21 92.77,63.69 | C7.2 92.71,62.97 | 44.32,27.69 44.2,27.69 BOOT.1
  Bottom 0.508: EXP1.13 29.72,36.32 27.81,34.42 27.81,31.37 30.23,28.96 v30.23,27.69
12V  (via drill 0.51, 1.02)  (1 unrouted)
  Top 0.254: R26.1 18.54,36.07 v17.78,36.83 | R24.1 18.8,49.28 v17.53,50.55 | R25.1 18.54,62.74 v17.53,63.75
  Top 0.508: LM7805.IN 89.6,67.63 C5.2 89.41,63.82 89.41,61.21 82.74,54.54 R27.2 84.33,51.5 84.33,45.21 85.6,43.94 108.97,43.94 111,41.91 111,33.27 108.2,30.48 C12.1 | EXP1.15 28.19,33.78 23.88,38.1 v17.27,38.1 | R30.1 25.91,65.02 FAN1.1 | R23.1 33.02,65.53 FAN.1
  Top 0.762: P5.VMOT 22.86,12.32 21.46,13.72 | C4.+ 41.78,13.59 43.18,12.19 P4.VMOT | C3.+ 62.04,13.78 63.5,12.32 P3.VMOT | C2.+ 82.36,13.78 83.82,12.32 P2.VMOT | C1.+ 102.93,13.78 104.14,12.57 P1.VMOT
  Bottom 0.508: FAN.1 33.53,67.82 32.51,68.83 26.67,68.83 | 26.67,68.83 18.03,68.83 17.78,69.09 | FAN1.1 26.92,68.58 26.67,68.83
  Bottom 2.032: C12.1 108.2,14.73 107.95,14.48
  pour Bottom (no thermals): 18.29,16 18.54,15.75 117.6,15.75 117.6,-0.25 0,-0.25 0,73.66 18.29,73.66
!E1-ENABLE  (via drill 0.51)
  Top 0.254: P5.!EN 23.18,23.69 R22.2 23.18,27.24 26.42,30.48 33.27,30.48 44.34,41.55 44.81,41.55 v44.96,41.4 | AT90USB1287.36 45,44.75 v44.96,44.73
  Bottom 0.254: v44.96,41.4 v44.96,44.73
!E-ENABLE  (via drill 0.6)
  Top 0.254: P4.!EN 43.5,23.69 R17.2 43.5,25.97 43.69,26.16 39.88,26.16 v39.37,26.67 | v39.62,40.39 43.15,43.92 46.79,43.92 AT90USB1287.37 | 46.79,43.97 46.84,43.92 46.84,43.97 AT90USB1287.37 | AT90USB1287.37
  Bottom 0.254: v39.62,40.39 39.62,26.92 v39.37,26.67
!HOTBED  (via drill 0.51)
  Top 0.254: R11.1 22.16,30.55 24.13,32.51 v24.13,35.31 24.13,33.78 | AT90USB1287.35 40.98,45.55 v40.89,45.47
  Top 0.508: R11.1 16.07,30.55 Q2.1
  Bottom 0.254: v24.13,35.31 24.13,40.89 28.45,45.21 40.64,45.21 v40.89,45.47
!HOTEND  (via drill 0.51)
  Top 0.254: R6.1 22.03,56.96 24.13,54.86 24.13,53.85 v27.69,50.29 | AT90USB1287.33 41.24,47.15 v40.39,48.01
  Top 0.508: R6.1 16.07,56.96 Q1.1
  Bottom 0.254: v27.69,50.29 38.1,50.29 v40.39,48.01
!HOTEND1  (via drill 0.51)
  Top 0.254: R19.1 23.69,43.75 v27.69,47.75 | v39.37,46.99 39.88,46.99 40.52,46.35 AT90USB1287.34
  Top 0.508: R19.1 16.07,43.75 Q5.1
  Bottom 0.254: v27.69,47.75 38.61,47.75 v39.37,46.99
!PWM-FAN  (via drill 0.51)
  Top 0.254: AT90USB1287.41 49.13,40.75 49.78,41.4 49.78,45.97 v48.26,47.5 | v36.58,55.88 36.58,57.72 R14.1
  Top 0.508: R14.1 Q3.1
  Bottom 0.254: v48.26,47.5 39.88,55.88 v36.58,55.88
!PWM-FANE  (via drill 0.51)
  Top 0.254: AT90USB1287.40 48.66,41.55 49.02,41.91 49.02,45.47 v48.51,45.97 | v29.21,55.88 29.21,57.91 R29.1
  Top 0.508: R29.1 Q6.1
  Bottom 0.254: v48.51,45.97 39.62,54.86 30.23,54.86 v29.21,55.88
!RESET  (via drill 0.6)
  Top 0.254: R12.1 61.15,50.04 58.67,50.04 58.21,49.57 AT90USB1287.20 58.21,45.68 v58.67,45.21 | ISP.5 72.39,39.62 v70.87,41.15 | RESET.3 RESET.4
  Bottom 0.254: RESET.4 66.32,45.21 | 66.32,45.21 66.32,42.65 67.82,41.15 v70.87,41.15 | v58.67,45.21 66.32,45.21
!X-ENABLE  (via drill 0.51)  (1 unrouted)
  Top 0.254: R18.2 103.82,26.74 103.38,27.43 92.2,27.43 89.92,29.72 v82.55,29.72 | v70.87,29.72 64.64,35.95 AT90USB1287.2 | P1.!EN 104.14,25.65 103.89,25.91
  Bottom 0.254: v70.87,29.72 v82.55,29.72
!Y-ENABLE  (via drill 0.6)
  Top 0.254: P2.!EN 84.14,23.69 R15.2 80.26,25.91 v79.76,26.42 | AT90USB1287.1 64.17,35.15 70.61,28.83 v77.85,28.83
  Bottom 0.254: v79.76,26.42 79.76,26.92 v77.85,28.83
!Z-ENABLE  (via drill 0.51)
  Top 0.254: P3.!EN 63.82,23.69 R16.2 51.05,25.91 v50.8,26.16 | AT90USB1287.42 48.95,39.95 49.53,39.37 v49.53,35.31
  Bottom 0.254: v49.53,35.31 49.53,27.43 v50.8,26.16
+3V3
  Top 0.508: R28.2 89.21,54.74 IC3.1 95.76,58.06 95.76,60.71 95.92,60.87 97.81,60.87 C19.2 | C19.2 112.84,60.64 113.54,59.94 113.54,56.39 112.78,55.63 112.02,55.63 MICRO-SD.4 | IC1.3 97.94,60.74 C19.2
A0  (via drill 0.51)
  Top 0.254: AT90USB1287.61 58.21,38.82 v56.64,40.39
  Bottom 0.254: v56.64,40.39 44.2,40.39 41.4,43.18 34.54,43.18 34.04,42.67 31.24,42.67 EXP1.9
A1  (via drill 0.51)
  Top 0.254: AT90USB1287.60 57.41,38.09 v56.39,39.12
  Bottom 0.254: v56.39,39.12 55.88,39.62 44.2,39.62 41.15,42.67 36.58,42.67 35.31,41.4 EXP1.10
A2  (via drill 0.51)
  Top 0.254: AT90USB1287.59 56.61,36.86 v55.88,37.59
  Bottom 0.254: v55.88,37.59 54.36,39.12 43.94,39.12 40.89,42.16 37.08,42.16 35.05,40.13 31.24,40.13 EXP1.11
A3  (via drill 0.51)  (1 unrouted)
  Top 0.254: AT90USB1287.58 55.81,35.88 v55.37,36.32
  Bottom 0.254: v55.37,36.32 53.09,38.61 43.69,38.61 40.64,41.66 37.59,41.66 34.8,38.86 32.77,38.86
ALE  (via drill 0.6)  (1 unrouted)
  Top 0.254: BOOT.2 40.39,33.02 38.86,31.5 | AT90USB1287.43 47.47,39.15 48.51,38.1 v48.51,36.83
  Bottom 0.254: v48.51,36.83 43.69,36.83 41.4,34.54 BOOT.2
B-THERM  (via drill 0.51, 0.6)
  Top 0.254: AT90USB1287.54 52.61,42.45 v52.83,42.67 | R10.1 40.12,62.56 C9.2 40.13,60.82 40.13,59.69 41.91,57.91 v41.91,55.63
  Top 0.508: R10.1 40.07,65.85 B-THERM.1
  Bottom 0.254: v41.91,55.63 52.83,44.7 v52.83,42.67
CARD_DETECT  (via drill 0.51)
  Top 0.254: MICRO-SD.CD1 101.28,54.04 v100.96,54.36 | AT90USB1287.19 59.01,47.92 v59.69,47.24
  Bottom 0.254: v59.69,47.24 62.61,47.24 69.72,54.36 v100.96,54.36
E1-DIR
  Top 0.254: AT90USB1287.38 43.91,43.15 32.51,31.75 24.89,31.75 18.8,25.65 6.6,25.65 5.08,24.13 P5.DIR
E1-STEP
  Top 0.254: AT90USB1287.39 44.13,42.35 33.02,31.24 25.4,31.24 19.3,25.15 8.64,25.15 7.62,24.13 P5.STEP
E1-THERM  (via drill 0.51, 0.6)
  Top 0.254: AT90USB1287.55 53.41,41.47 v54.1,42.16 | R20.1 45.71,62.43 C17.2 45.45,60.45 44.83,60.45 43.69,59.31 v43.69,55.63
  Top 0.508: R20.1 45.66,65.85 E1-THERM.1
  Bottom 0.254: v43.69,55.63 54.1,45.21 v54.1,42.16
E-DIR  (via drill 0.6)
  Top 0.254: v27.43,29.46 27.94,29.97 33.78,29.97 42.16,38.35 42.17,38.35 AT90USB1287.44
  Bottom 0.254: P4.DIR 25.4,23.62 26.92,25.15 26.92,28.96 v27.43,29.46
E-MOT-1A
  Top 2.032: P4.1A JP7.3
E-MOT-1A1
  Top 2.032: JP37.3 P5.1A
E-MOT-1B
  Top 2.032: P4.1B JP7.4
E-MOT-1B1
  Top 2.032: P5.1B JP37.4
E-MOT-2A
  Top 2.032: P4.2A JP7.2
E-MOT-2A1
  Top 2.032: JP37.2 P5.2A
E-MOT-2B
  Top 2.032: P4.2B JP7.1
E-MOT-2B1
  Top 2.032: P5.2B JP37.1
E-MS1
  Top 0.254: P4.MS1 39.75,22.48 JP16.1 39.81,21.21 41.27,21.21 41.66,20.83 R5.1
E-MS2
  Top 0.254: JP15.1 37.21,22.48 P4.MS2
E-MS3
  Top 0.254: JP21.1 34.67,22.48 P4.MS3
E-MS4
  Top 0.254: P5.MS1 19.43,22.48 JP19.1 19.49,21.21 21.08,21.21 21.46,20.83 R21.1
E-MS5
  Top 0.254: JP18.1 16.89,22.48 P5.MS2
E-MS6
  Top 0.254: JP17.1 14.35,22.48 P5.MS3
E-RESETSLEEP
  Top 0.254: P4.!SLP P4.!RST
E-RESETSLEEP1
  Top 0.254: P5.!SLP P5.!RST
E-STEP  (via drill 0.6)
  Top 0.254: v28.7,28.96 28.96,28.96 29.46,29.46 34.29,29.46 42.42,37.59 46.77,37.59 AT90USB1287.45
  Bottom 0.254: P4.STEP 27.94,28.19 v28.7,28.96
E-THERM  (via drill 0.51, 0.6)  (1 unrouted)
  Top 0.254: AT90USB1287.56 54.21,40.49 v55.37,41.66 | 51.25,60.88 C10.2 50.66,60.2 49.28,60.2 48.26,59.18 45.47,59.18 v45.47,55.63
  Top 0.508: R9.1 51.25,65.85 E0-THERM.1
  Bottom 0.254: v55.37,41.66 55.37,45.72 v45.47,55.63
GND  (via drill 0.51, 0.6)  (1 unrouted)
  Top 0.254: AT90USB1287.63 59.81,32.14 60.96,30.99 | AT90USB1287.6 65.5,39.15 66.04,38.61 C11.1 | AT90USB1287.22 56.61,51.16 C14.2
  other vias: 25.4,32.77 63.5,32.77 51.31,44.45 56.13,46.99 23.88,49.02 22.61,40.89 92.46,25.91 23.37,19.56 53.85,31.75 36.83,29.21 88.65,56.39 43.69,60.71 49.66,61.59 56.64,61.47 61.98,61.47 55.37,55.37 60.71,46.23 96.14,56.52 108.33,59.18 68.33,40.13
  pour Top: 0,73.66 117.6,73.66 117.6,-0.25 0,-0.25
  pour Bottom: 19.3,73.66 19.3,16.51 117.6,16.51 117.6,73.66
HOTBED-GND
  Top 0.254: Q2.2 17.49,32.77 LED5.C
  Top 2.54: Q2.2 9.32,32.77 HOTBED.2
  Bottom 2.54: 6.86,35.05 7.11,35.05 9.4,32.77 Q2.2
HOTEND-GND
  Top 0.254: Q1.2 17.49,59.18 LED4.C
  Top 2.54: Q1.2 9.32,59.18 HOTEND-0.2
  Bottom 2.54: 6.86,61.72 9.4,59.18 15.49,59.18 15.75,59.44 Q1.2
HOTEND-GND1  (2 unrouted)
  Top 0.254: Q5.2 17.53,45.97 19.05,47.5
  Top 2.54: Q5.2 9.32,45.97 HOTEND-1.2
  Bottom 2.54: 6.86,48.26 9.14,45.97 16,45.97
MISO  (via drill 0.51)
  Top 0.254: AT90USB1287.13 72.85,44.75 ISP.1 | MICRO-SD.7 109.08,52.18 v108.33,51.44
  Bottom 0.254: ISP.1 74.42,46.23 86.74,46.23 90.42,49.91 106.81,49.91 v108.33,51.44
MOSI  (via drill 0.51)
  Top 0.254: AT90USB1287.12 71.11,43.95 71.63,43.43 74.17,43.43 ISP.4 | IC3.5 91.44,49.66 v88.14,46.36
  Bottom 0.254: ISP.4 83.95,42.16 v88.14,46.36
N$1
  Top 0.254: R1.1 75.76,51.15 5V.A
N$2  (via drill 0.51)
  Top 0.254: R7.1 74.42,35.81 77.47,38.86 v78.23,38.86
  Bottom 0.254: J1.D- 103.14,39.9 102.62,39.37 78.74,39.37 v78.23,38.86
N$3
  Top 0.254: AT90USB1287.4 64.05,37.55 65.79,35.81 R7.2
N$4  (1 unrouted)
  Top 0.254: R8.2 64.77,37.85 64.26,38.35 62.48,38.35
N$5  (via drill 0.51)
  Top 0.254: R8.1 v73.91,37.85
  Bottom 0.254: v73.91,37.85 103.1,37.85 J1.D+
N$6
  Top 0.508: FAN.2 37.34,64.77 Q3.3 35.41,61.86 LED2.C
N$7  (via drill 0.51)
  Top 0.254: AT90USB1287.9 61.58,41.55 60.71,42.42 60.71,43.43 v60.45,43.69
  Bottom 0.254: JP34.1 70.61,33.53 v60.45,43.69
N$8
  Top 0.508: R23.2 34.7,59.5 LED2.A
N$9
  Top 0.254: AT90USB1287.7 65.21,39.95 C11.2
N$10
  Top 0.254: R28.1 85.66,50.65 3V3.A
N$11  (1 unrouted)
  Top 0.254: LED4.A 21.12,62.7 21.08,62.74
N$12
  Top 0.254: LED3.A 21.12,49.18 R24.2
N$13
  Top 0.254: LED5.A 21.12,35.97 R26.2
N$14
  Top 0.254: R27.1 80.84,50.65 12V.A
N$16  (via drill 0.51)
  Top 0.254: IC3.6 94.23,48.39 v96.65,50.8 | MICRO-SD.5 109.76,54.38 v108.33,52.96
  Bottom 0.254: v108.33,52.96 107.44,52.96 106.43,51.94 97.79,51.94 v96.65,50.8
N$17  (via drill 0.51)
  Top 0.254: IC3.4 93.98,50.93 v95.88,52.83 | MICRO-SD.3 109.92,56.58 v108.08,54.74
  Bottom 0.254: v95.88,52.83 105.03,52.83 106.93,54.74 v108.08,54.74
N$18
  Top 0.254: IC3.2 95,53.47 97.15,55.63 107.7,55.63 109.73,57.66 111,57.66 111.12,57.79 111.12,57.66 | 111.12,57.66 111.12,57.53 | MICRO-SD.2 111.1,57.68 111.12,57.66
N$20
  Top 0.508: FAN1.2 30.23,65.28 Q6.3 28.04,61.86 LED1.C
N$21
  Top 0.508: R30.2 27.59,59.5 LED1.A
PB0-SS  (via drill 0.51)
  Top 0.254: IC3.3 91.19,52.2 v86.87,47.88 | AT90USB1287.10 69.03,42.35 v69.09,42.29
  Bottom 0.254: v69.09,42.29 69.09,42.8 73.41,47.12 86.11,47.12 v86.87,47.88
PD0-SCL
  Top 0.254: AT90USB1287.25 54.21,51.45 51.82,53.85 32.26,53.85 EXP1.1
PD1-SDA
  Top 0.254: AT90USB1287.26 53.41,51.24 51.31,53.34 34.29,53.34 EXP1.2
PD2-RX1
  Top 0.254: AT90USB1287.27 52.61,51.02 50.8,52.83 35.81,52.83 33.27,50.29 31.24,50.29 EXP1.3
PD3-TX1
  Top 0.254: AT90USB1287.28 51.81,50.81 50.29,52.32 37.08,52.32 33.78,49.02 EXP1.4
PD4
  Top 0.254: AT90USB1287.29 51.01,50.59 49.78,51.82 37.85,51.82 33.78,47.75 31.24,47.75 EXP1.5
PD5
  Top 0.254: AT90USB1287.30 50.21,50.37 49.28,51.31 38.86,51.31 34.04,46.48 EXP1.6
PD6
  Top 0.254: AT90USB1287.31 49.41,50.16 48.77,50.8 39.37,50.8 33.78,45.21 31.24,45.21 EXP1.7
PD7
  Top 0.254: AT90USB1287.32 48.61,49.94 48.26,50.29 40.13,50.29 33.78,43.94 EXP1.8
SCLK  (via drill 0.51)
  Top 0.254: AT90USB1287.11 70.39,43.15 71.37,42.16 ISP.3 | IC3.7 91.06,47.12 v89.03,45.09
  Bottom 0.254: ISP.3 74.17,40.89 84.84,40.89 v89.03,45.09
X-DIR  (via drill 0.51)
  Top 0.254: AT90USB1287.50 49.41,31.36 50.55,30.23 v56.64,30.23 | v87.88,25.65 87.88,24.89 P1.DIR
  Bottom 0.254: v56.64,30.23 57.66,30.23 58.17,30.73 82.8,30.73 v87.88,25.65
X-MOT-1A
  Top 2.032: JP1.3 P1.1A
X-MOT-1B
  Top 2.032: JP1.4 P1.1B
X-MOT-2A
  Top 2.032: JP1.2 P1.2A
X-MOT-2B
  Top 2.032: JP1.1 P1.2B
X-MS1  (via drill 0.51)
  Top 0.254: R2.1 v98.81,25.91 | JP24.1 100.71,22.48 P1.MS1
  Bottom 0.254: P1.MS1 101.35,23.37 v98.81,25.91
X-MS2
  Top 0.254: JP22.1 98.17,22.48 P1.MS2
X-MS3
  Top 0.254: JP20.1 95.63,22.48 P1.MS3
X-RESETSLEEP
  Top 0.254: P1.!SLP P1.!RST
X-STEP  (via drill 0.51)
  Top 0.254: AT90USB1287.51 50.21,31.83 51.31,30.73 55.88,30.73 v56.64,31.5 | v88.9,26.42 P1.STEP
  Bottom 0.254: v56.64,31.5 83.82,31.5 v88.9,26.42
X-STOP
  Top 0.254: AT90USB1287.15 64.38,46.35 64.77,46.74 64.77,62.74 66.04,64.01 70.87,64.01 X-STOP.1
XTAL1
  Top 0.254: AT90USB1287.24 55.01,52.18 52.07,55.12 50.8,55.12 | 50.8,55.12 50.75,55.12 Q4.2 50.8,55.12 | 50.8,55.12 | 50.8,55.12 50.8,59.03 C8.1
XTAL2
  Top 0.254: C15.1 60.92,55.64 Q4.1 60.96,55.12 | AT90USB1287.23 55.81,52.51 58.42,55.12 60.96,55.12 | 60.96,55.12
Y-DIR  (via drill 0.51)
  Top 0.254: AT90USB1287.48 46.81,32.18 50.55,28.45 61.47,28.45 v61.72,28.7 | P2.DIR 66.04,23.88 67.31,25.15 v67.31,26.16
  Bottom 0.254: v67.31,26.16 67.31,27.43 66.04,28.7 v61.72,28.7
Y-MOT-1A
  Top 2.032: JP3.3 P2.1A
Y-MOT-1B
  Top 2.032: JP3.4 P2.1B
Y-MOT-2A
  Top 2.032: JP3.2 P2.2A
Y-MOT-2B
  Top 2.032: JP3.1 P2.2B
Y-MS1
  Top 0.254: P2.MS1 80.39,22.48 JP12.1 80.45,21.21 81.66,21.21 82.04,20.83 R3.1
Y-MS2
  Top 0.254: JP13.1 77.85,22.48 P2.MS2
Y-MS3
  Top 0.254: JP14.1 75.31,22.48 P2.MS3
Y-RESETSLEEP
  Top 0.254: P2.!SLP P2.!RST
Y-STEP  (via drill 0.51)
  Top 0.254: AT90USB1287.49 48.61,31.15 50.55,29.21 60.96,29.21 61.47,29.72 v62.74,29.72 | P2.STEP v68.58,26.16
  Bottom 0.254: v62.74,29.72 66.29,29.72 68.58,27.43 v68.58,26.16
Y-STOP
  Top 0.254: AT90USB1287.16 63.66,47.15 64.26,47.75 64.26,62.99 64.77,63.5 Y-STOP.1
Z-DIR  (via drill 0.6)
  Top 0.254: AT90USB1287.46 45.13,36.75 43.18,34.8 v43.18,33.53
  Bottom 0.254: P3.DIR 45.72,24.38 46.48,25.15 46.48,30.23 v43.18,33.53
Z-MOT-1A
  Top 2.032: P3.1A JP35.3
Z-MOT-1B
  Top 2.032: P3.1B JP35.4
Z-MOT-2A
  Top 2.032: P3.2A JP35.2
Z-MOT-2B
  Top 2.032: P3.2B JP35.1
Z-MS1
  Top 0.254: P3.MS1 60.07,22.48 JP11.1 60.13,21.21 61.6,21.21 61.98,20.83 R4.1
Z-MS2
  Top 0.254: JP10.1 57.53,22.48 P3.MS2
Z-MS3
  Top 0.254: JP9.1 54.99,22.48 P3.MS3
Z-RESETSLEEP
  Top 0.254: P3.!SLP P3.!RST
Z-STEP  (via drill 0.6)
  Top 0.254: AT90USB1287.47 45.6,35.95 45.21,35.56 v45.21,33.02
  Bottom 0.254: P3.STEP 48.26,29.97 v45.21,33.02
Z-STOP
  Top 0.254: AT90USB1287.17 60.79,48.77 62.99,48.77 63.75,49.53 63.75,62.74 63.5,62.99 59.69,62.99 Z-STOP.1

### Text on the board
tNames: FAN-E | FAN-H | B-T | E1-T | E0-T | Z-STOP | Y-STOP | X-STOP | PD1 | PD2 | PD3 | PD4 | PD5 | PD7 | 4050D | PD6 | A0 | A1 | Sunbeam rev.B | A3 | A2 | 5V | GND | 12V | E1 | E0 | Z | Y | X